# Altium schematic sheet MCU.SchDoc
size A4
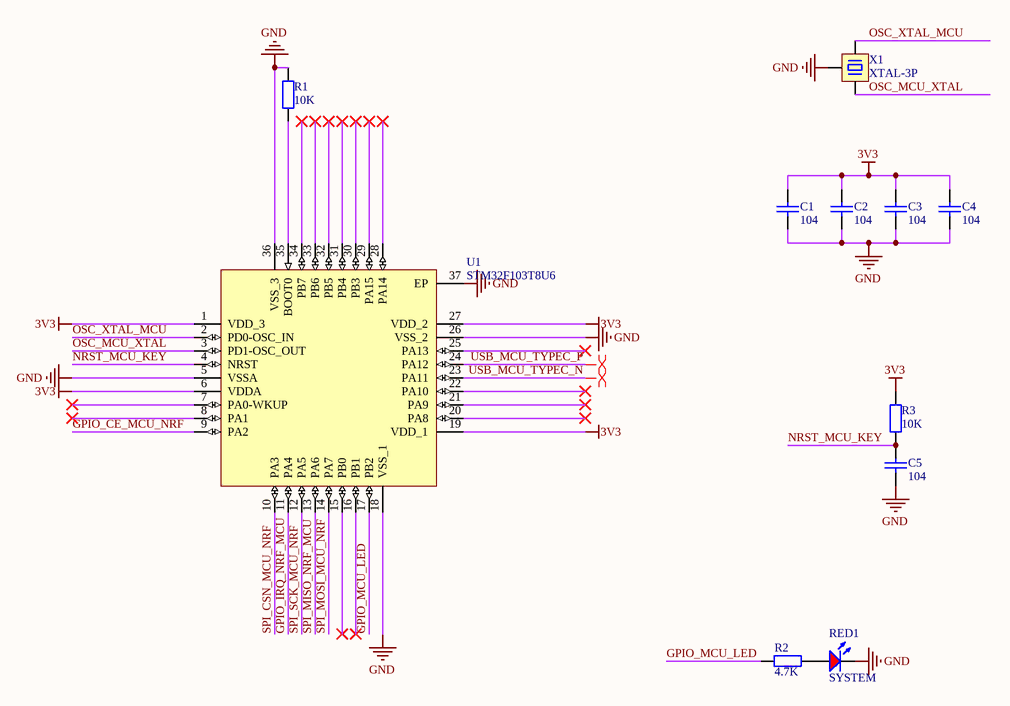
[diagram p0: MCU.SchDoc]

## Parts
C1  104  [Cap-0402-M]
C2  104  [Cap-0402-M]
C3  104  [Cap-0402-M]
C4  104  [Cap-0402-M]
C5  104  [Cap-0402-M]
R1  10K  [Res-0402-M]
R2  4.7K  [Res-0402-M]
R3  10K  [Res-0402-M]
RED1  SYSTEM  [LED_0603_R]
U1  STM32F103T8U6  [STM-VFQFPN36_L _2]
X1  XTAL-3P  [OSC 3213-3P]

## Nets
3V3: C1.2 C2.2 C3.2 C4.2 R3.2 U1.1(VDD_3) U1.6(VDDA) U1.19(VDD_1) U1.27(VDD_2)
GND: C1.1 C2.1 C3.1 C4.1 C5.1 R1.2 RED1.2(K) U1.5(VSSA) U1.18(VSS_1) U1.26(VSS_2) U1.36(VSS_3) U1.37(EP) X1.2
GPIO_CE_MCU_NRF: U1.9(PA2)
GPIO_IRQ_NRF_MCU: U1.11(PA4)
GPIO_MCU_LED: R2.2 U1.17(PB2)
NRST_MCU_KEY: C5.2 R3.1 U1.4(NRST)
OSC_MCU_XTAL: U1.3(PD1-OSC_OUT) X1.3
OSC_XTAL_MCU: U1.2(PD0-OSC_IN) X1.1
SPI_CSN_MCU_NRF: U1.10(PA3)
SPI_MISO_NRF_MCU: U1.13(PA6)
SPI_MOSI_MCU_NRF: U1.14(PA7)
SPI_SCK_MCU_NRF: U1.12(PA5)
USB_MCU_TYPEC_N: U1.23(PA11)
USB_MCU_TYPEC_P: U1.24(PA12)
NetR1_1: R1.1 U1.35(BOOT0)
NetR2_1: R2.1 RED1.1(A)

Not connected (* = marked no-connect by the designer): U1 7(PA0-WKUP)* 8(PA1)* 15(PB0)* 16(PB1)* 20(PA8)* 21(PA9)* 22(PA10)* 25(PA13)* 28(PA14)* 29(PA15)* 30(PB3)* 31(PB4)* 32(PB5)* 33(PB6)* 34(PB7)*

## Layout directives
differential pair: USB_MCU_TYPEC_N, USB_MCU_TYPEC_P

## Library data of the parts
C1-C5 = CAP: 贴片陶瓷电容
R1-R3 = RES: 贴片电阻
RED1 = LED_SMD_RED: 发光二极管; ComponentLink1Description: 供应商链接; ComponentLink1URL: http://www.szlcsc.com/product/details_2659.html; Package: 0603; Supplier: LC; SuppliersPartNumber: C2286
U1 = STM32F103T8U6: ARM Cortex-M3 32-bit MCU, 64 KB Flash, 20 KB Internal RAM, 26 I/Os, 36-pin VFQFPN, -40 to 85 degC, Tray; A/D Converter: 2x12-bit (10 Channel); FLASH Size (Prog) (kB): 64; I/Os (High Current): 26; Internal RAM Size (kB): 20; Operating Frequency(F) (Processor speed) (MHz): 72; Supply Voltage(Vcc) min (V): 2; DatasheetVersion: Rev. 16; PackageVersion: Rev. 16, 08/2013; PackageReference: VFQFPN36; PackageDescription: 36-Pin Quad Flat No-Lead, 6 x 6 x 1.0 mm Body, 0.5 mm Pitch, Exposed Pad; Supplier 1: Digi-Key; Supplier Part Number 1: 497-11532-ND; Supplier 2: Farnell; Supplier Part Number 2: 1606329; Supplier 3: Newark; Supplier Part Number 3: 11N8298; Supplier 4: Mouser; Supplier Part Number 4: 511-STM32F103T8U6; Core: ARM Cortex-M3; Packing: Tray; Mounting Technology: Surface Mount; PartNumber: STM32F103T8U6; ComponentLink1Description: Manufacturer URL; ComponentLink1URL: http://www.st.com/web/en/home.html; ComponentLink2Description: Datasheet; ComponentLink2URL: http://www.st.com/st-web-ui/static/active/en/resource/technical/document/datasheet/CD00161566.pdf; ComponentLink3Description: Package Specification; ComponentLink3URL: http://www.st.com/st-web-ui/static/active/en/resource/technical/document/datasheet/CD00161561.pdf
X1 = XTAL-3P: 3脚无源晶振带电容